# Altium schematic sheet Neural_Interface.SchDoc
size A4; DocumentNumber: 1; SheetNumber: 1; SheetTotal: 2
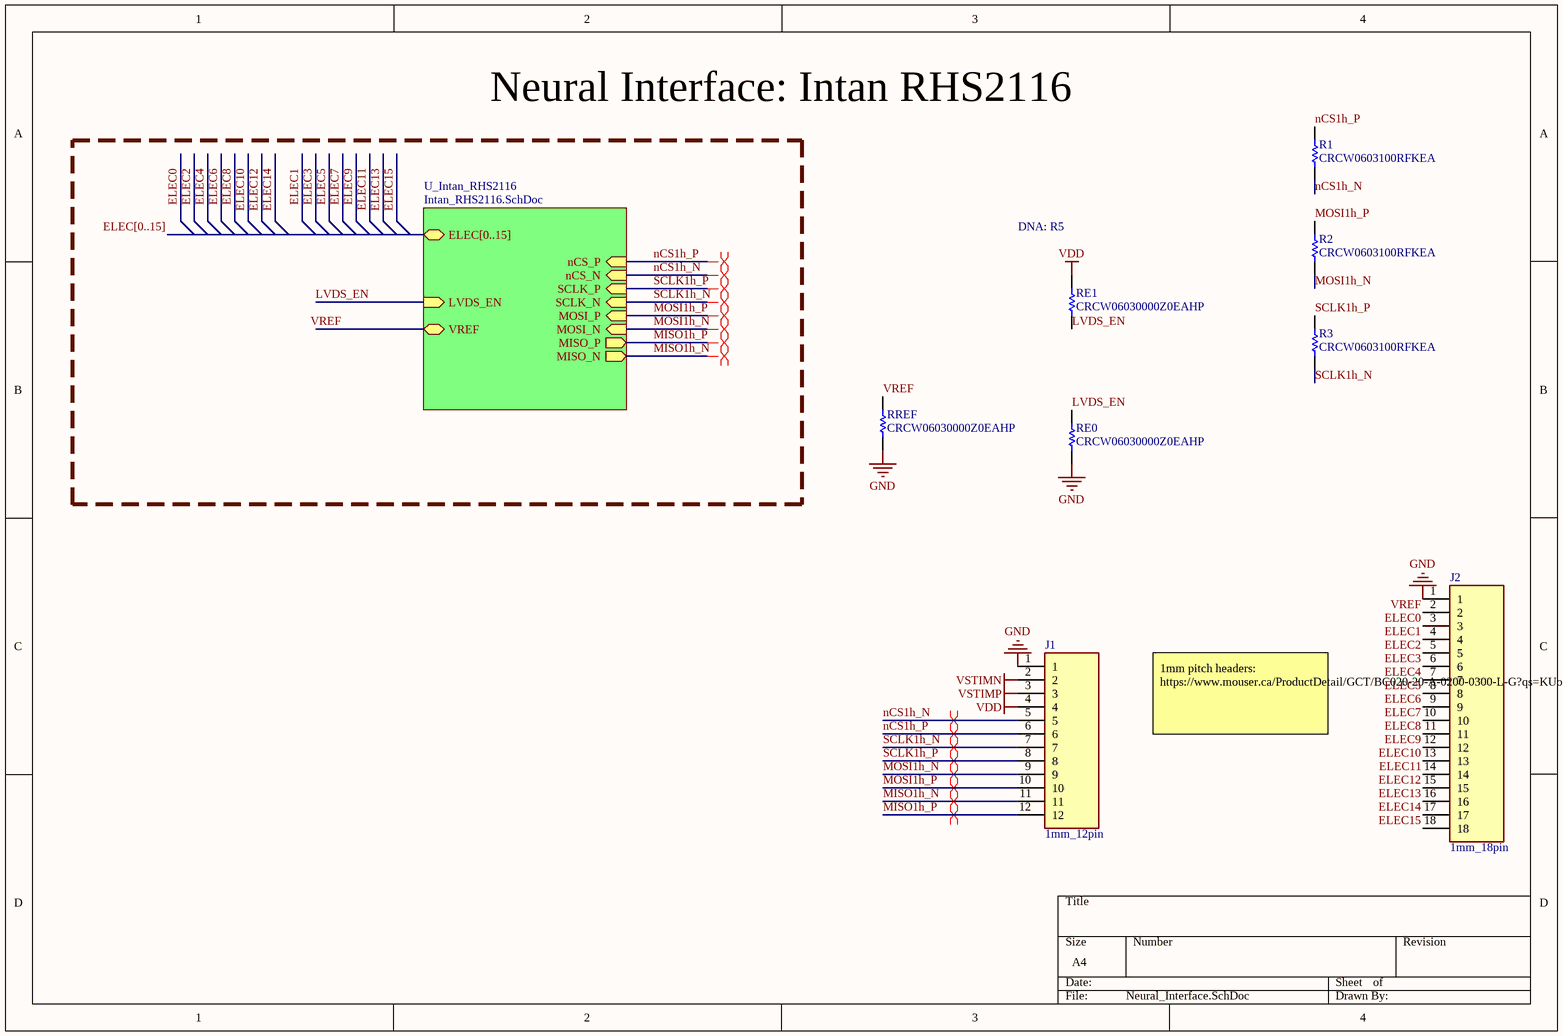
[diagram p0: Neural_Interface.SchDoc]

## Parts
J1  1mm_12pin  [1mm_12pin]
J2  1mm_18pin  [1mm_18pin]
R1  CRCW0603100RFKEA  [RESC1609X50X30ML8T20]
R2  CRCW0603100RFKEA  [RESC1609X50X30ML8T20]
R3  CRCW0603100RFKEA  [RESC1609X50X30ML8T20]
RE0  CRCW06030000Z0EAHP  [RESC1609X55X30NL10T20]
RE1  CRCW06030000Z0EAHP  [RESC1609X55X30NL10T20]
RREF  CRCW06030000Z0EAHP  [RESC1609X55X30NL10T20]

## Sub-sheets
U_Intan_RHS2116 = Intan_RHS2116.SchDoc: nCS_N (in), nCS_P (in), SCLK_N (in), SCLK_P (in), MOSI_N (in), MOSI_P (in), MISO_N (out), MISO_P (out), ELEC[0..15] (bidir), LVDS_EN (in), VREF (bidir)

## Nets
GND: J1.1 J2.1 RE0.1 RREF.1
VDD: J1.4 RE1.2
VSTIMN: J1.2
VSTIMP: J1.3
ELEC0: J2.3
ELEC1: J2.4
ELEC2: J2.5
ELEC3: J2.6
ELEC4: J2.7
ELEC5: J2.8
ELEC6: J2.9
ELEC7: J2.10
ELEC8: J2.11
ELEC9: J2.12
ELEC10: J2.13
ELEC11: J2.14
ELEC12: J2.15
ELEC13: J2.16
ELEC14: J2.17
ELEC15: J2.18
LVDS_EN: RE0.2 RE1.1 ; sheet U_Intan_RHS2116/LVDS_EN
MISO1h_N: J1.11 ; sheet U_Intan_RHS2116/MISO_N
MISO1h_P: J1.12 ; sheet U_Intan_RHS2116/MISO_P
MOSI1h_N: J1.9 R2.1 ; sheet U_Intan_RHS2116/MOSI_N
MOSI1h_P: J1.10 R2.2 ; sheet U_Intan_RHS2116/MOSI_P
nCS1h_N: J1.5 R1.1 ; sheet U_Intan_RHS2116/nCS_N
nCS1h_P: J1.6 R1.2 ; sheet U_Intan_RHS2116/nCS_P
SCLK1h_N: J1.7 R3.1 ; sheet U_Intan_RHS2116/SCLK_N
SCLK1h_P: J1.8 R3.2 ; sheet U_Intan_RHS2116/SCLK_P
VREF: J2.2 RREF.2 ; sheet U_Intan_RHS2116/VREF

## Buses and harness runs
bus ELEC[0..15] = sheet U_Intan_RHS2116/ELEC[0..15]

## Layout directives
differential pair: MISO1h_N, MISO1h_P, MOSI1h_N, MOSI1h_P, nCS1h_N, nCS1h_P, SCLK1h_N, SCLK1h_P

## Notes on the sheet
- Neural Interface: Intan RHS2116
- DNA: R5
- 1mm pitch headers:
  https://www.mouser.ca/ProductDetail/GCT/BC020-20-A-0200-0300-L-G?qs=KUoIvG%2F9IlZq9%252BZjjQuDpw%3D%3D

## Library data of the parts
R1-R3 = CMP-1666-00008-4: Chip Resistor, 100 Ohm, +/- 1%, 100 mW,-55 to 155 degC, 0603 (1608 Metric), RoHS, Tape and Ree; Manufacturer: Vishay Semiconductor; ComponentLink2URL: http://www.vishay.com/docs/20035/dcrcwe3.pdf; ComponentLink1URL: http://www.vishay.com/; Mounting Technology: Surface Mount; ComponentLink1Description: Manufacturer URL; ComponentLink2Description: Datasheet; PackageDescription: 2-Pin Surface Mount Device, Body 1.575 x 0.85 mm; PackageReference: 0603; DatasheetVersion: 06/2012
RE0 RE1 RREF = CMP-2000-03817-1: Manufacturer: Vishay Dale; Part Number: CRCW06030000Z0EAHP